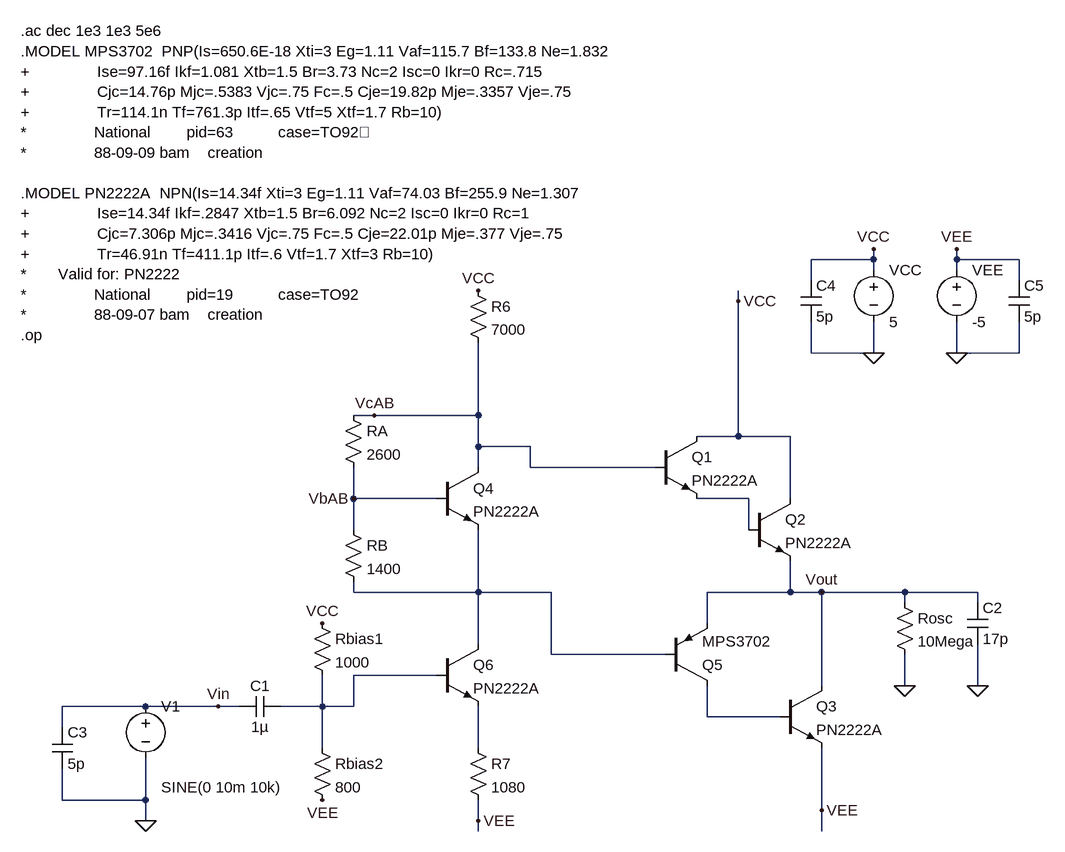
[diagram p0: schematic ClassAB_freq.asc]
ClassAB_freq.asc, the LTspice schematic file:
Version 4
SHEET 1 1032 816
WIRE 768 -160 768 -176
WIRE 768 -160 672 -160
WIRE 896 -160 896 -176
WIRE 992 -160 896 -160
WIRE 768 -144 768 -160
WIRE 896 -144 896 -160
WIRE 672 -128 672 -160
WIRE 992 -128 992 -160
WIRE 560 -96 560 -112
WIRE 672 -16 672 -64
WIRE 768 -16 768 -64
WIRE 768 -16 672 -16
WIRE 896 -16 896 -64
WIRE 992 -16 992 -64
WIRE 992 -16 896 -16
WIRE 0 80 -32 80
WIRE 160 80 160 -32
WIRE 160 80 0 80
WIRE 560 112 560 -96
WIRE 560 112 496 112
WIRE 640 112 560 112
WIRE 160 128 160 80
WIRE 240 128 160 128
WIRE 160 160 160 128
WIRE 240 160 240 128
WIRE 432 160 240 160
WIRE -32 208 -32 160
WIRE 96 208 -32 208
WIRE 576 208 496 208
WIRE 640 208 640 112
WIRE -32 256 -32 208
WIRE 576 256 576 208
WIRE -32 352 -32 336
WIRE 160 352 160 256
WIRE 160 352 -32 352
WIRE 272 352 160 352
WIRE 640 352 640 304
WIRE 640 352 512 352
WIRE 688 352 640 352
WIRE 816 352 688 352
WIRE 928 352 816 352
WIRE 816 368 816 352
WIRE 928 368 928 352
WIRE 512 400 512 352
WIRE 160 432 160 352
WIRE 272 448 272 352
WIRE 448 448 272 448
WIRE 96 480 -32 480
WIRE 688 496 688 352
WIRE 816 496 816 448
WIRE 928 496 928 432
WIRE -352 528 -480 528
WIRE -240 528 -352 528
WIRE -208 528 -240 528
WIRE -80 528 -80 480
WIRE -80 528 -144 528
WIRE -32 528 -32 480
WIRE -32 528 -80 528
WIRE 512 544 512 496
WIRE 624 544 512 544
WIRE -480 560 -480 528
WIRE -80 592 -80 528
WIRE 160 592 160 528
WIRE -480 672 -480 624
WIRE -352 672 -352 608
WIRE -352 672 -480 672
WIRE 688 688 688 592
WIRE -352 704 -352 672
WIRE 160 704 160 672
WIRE 160 720 160 704
WIRE 688 720 688 688
FLAG 896 -16 0
FLAG 0 80 VcAB
FLAG -32 208 VbAB
FLAG 688 352 Vout
FLAG -80 672 VEE
FLAG -80 400 VCC
FLAG -352 704 0
FLAG 768 -16 0
FLAG -240 528 Vin
FLAG 160 -112 VCC
FLAG 560 -96 VCC
FLAG 160 704 VEE
FLAG 688 688 VEE
FLAG 816 496 0
FLAG 928 496 0
FLAG 768 -176 VCC
FLAG 896 -176 VEE
DATAFLAG 32 480 "$"
SYMBOL npn 432 112 R0
SYMATTR InstName Q1
SYMATTR Value PN2222A
SYMBOL npn 576 208 R0
SYMATTR InstName Q2
SYMATTR Value PN2222A
SYMBOL npn 624 496 R0
SYMATTR InstName Q3
SYMATTR Value PN2222A
SYMBOL pnp 448 496 M180
SYMATTR InstName Q5
SYMATTR Value MPS3702
SYMBOL npn 96 160 R0
SYMATTR InstName Q4
SYMATTR Value PN2222A
SYMBOL npn 96 432 R0
SYMATTR InstName Q6
SYMATTR Value PN2222A
SYMBOL res 144 -128 R0
SYMATTR InstName R6
SYMATTR Value 7000
SYMBOL res -48 64 R0
SYMATTR InstName RA
SYMATTR Value 2600
SYMBOL res -48 240 R0
SYMATTR InstName RB
SYMATTR Value 1400
SYMBOL res 144 576 R0
SYMATTR InstName R7
SYMATTR Value 1080
SYMBOL voltage 896 -160 R0
SYMATTR InstName VEE
SYMATTR Value -5
SYMBOL res -96 576 R0
SYMATTR InstName Rbias2
SYMATTR Value 800
SYMBOL res -96 384 R0
SYMATTR InstName Rbias1
SYMATTR Value 1000
SYMBOL cap -144 512 R90
WINDOW 0 0 32 VBottom 2
WINDOW 3 32 32 VTop 2
SYMATTR InstName C1
SYMATTR Value 1µ
SYMBOL res 800 352 R0
SYMATTR InstName Rosc
SYMATTR Value 10Mega
SYMBOL cap 912 368 R0
SYMATTR InstName C2
SYMATTR Value 17p
SYMBOL voltage 768 -160 R0
SYMATTR InstName VCC
SYMATTR Value 5
SYMBOL voltage -352 512 R0
WINDOW 3 24 140 Left 2
SYMATTR Value SINE(0 10m 10k)
SYMATTR InstName V1
SYMATTR Value2 AC 10m
SYMBOL cap -496 560 R0
SYMATTR InstName C3
SYMATTR Value 5p
SYMBOL cap 656 -128 R0
SYMATTR InstName C4
SYMATTR Value 5p
SYMBOL cap 976 -128 R0
SYMATTR InstName C5
SYMATTR Value 5p
TEXT -544 -512 Left 2 !.ac dec 1e3 1e3 5e6\n.MODEL MPS3702  PNP(Is=650.6E-18 Xti=3 Eg=1.11 Vaf=115.7 Bf=133.8 Ne=1.832\n+               Ise=97.16f Ikf=1.081 Xtb=1.5 Br=3.73 Nc=2 Isc=0 Ikr=0 Rc=.715\n+               Cjc=14.76p Mjc=.5383 Vjc=.75 Fc=.5 Cje=19.82p Mje=.3357 Vje=.75\n+               Tr=114.1n Tf=761.3p Itf=.65 Vtf=5 Xtf=1.7 Rb=10)\n*               National        pid=63          case=TO92\n*               88-09-09 bam    creation\n\n.MODEL PN2222A  NPN(Is=14.34f Xti=3 Eg=1.11 Vaf=74.03 Bf=255.9 Ne=1.307\n+               Ise=14.34f Ikf=.2847 Xtb=1.5 Br=6.092 Nc=2 Isc=0 Ikr=0 Rc=1\n+               Cjc=7.306p Mjc=.3416 Vjc=.75 Fc=.5 Cje=22.01p Mje=.377 Vje=.75\n+               Tr=46.91n Tf=411.1p Itf=.6 Vtf=1.7 Xtf=3 Rb=10)\n*       Valid for: PN2222\n*               National        pid=19          case=TO92\n*               88-09-07 bam    creation\n.op

The netlist it stands for:
* ClassAB_freq.asc
Q1 VCC VcAB N001 0 PN2222A
Q2 VCC N001 Vout 0 PN2222A
Q3 Vout N004 VEE 0 PN2222A
Q5 N004 N002 Vout 0 MPS3702
Q4 VcAB VbAB N002 0 PN2222A
Q6 N002 N003 N005 0 PN2222A
R6 VCC VcAB 7000
RA VcAB VbAB 2600
RB VbAB N002 1400
R7 N005 VEE 1080
VEE VEE 0 -5
Rbias2 N003 VEE 800
Rbias1 VCC N003 1000
C1 N003 Vin 1µ
Rosc Vout 0 10Mega
C2 Vout 0 17p
VCC VCC 0 5
V1 Vin 0 SINE(0 10m 10k) AC 10m
C3 Vin 0 5p
C4 VCC 0 5p
C5 VEE 0 5p
.model NPN NPN
.model PNP PNP
.lib standard.bjt
.ac dec 1e3 1e3 5e6
.MODEL MPS3702  PNP(Is=650.6E-18 Xti=3 Eg=1.11 Vaf=115.7 Bf=133.8 Ne=1.832
+               Ise=97.16f Ikf=1.081 Xtb=1.5 Br=3.73 Nc=2 Isc=0 Ikr=0 Rc=.715
+               Cjc=14.76p Mjc=.5383 Vjc=.75 Fc=.5 Cje=19.82p Mje=.3357 Vje=.75
+               Tr=114.1n Tf=761.3p Itf=.65 Vtf=5 Xtf=1.7 Rb=10)
*               National        pid=63          case=TO92
*               88-09-09 bam    creation
.MODEL PN2222A  NPN(Is=14.34f Xti=3 Eg=1.11 Vaf=74.03 Bf=255.9 Ne=1.307
+               Ise=14.34f Ikf=.2847 Xtb=1.5 Br=6.092 Nc=2 Isc=0 Ikr=0 Rc=1
+               Cjc=7.306p Mjc=.3416 Vjc=.75 Fc=.5 Cje=22.01p Mje=.377 Vje=.75
+               Tr=46.91n Tf=411.1p Itf=.6 Vtf=1.7 Xtf=3 Rb=10)
*       Valid for: PN2222
*               National        pid=19          case=TO92
*               88-09-07 bam    creation
.op
.backanno
.end